# EasyEDA Pro project TOLL四合一电调.epro, schematic 100V_四路_功率板_HYG
Board Name: 100V_四路_功率板_HYG; Create Date: 2025-03-11; Page Name: P1; Project Name: 四合一电调底板; Schematic Name: 100V_四路_功率板_HYG; Update Date: 2025-03-11; Company: urmouky; Drawed: urmouky; Page Size: A4; Reviewed: urmouky; Version: V1.0
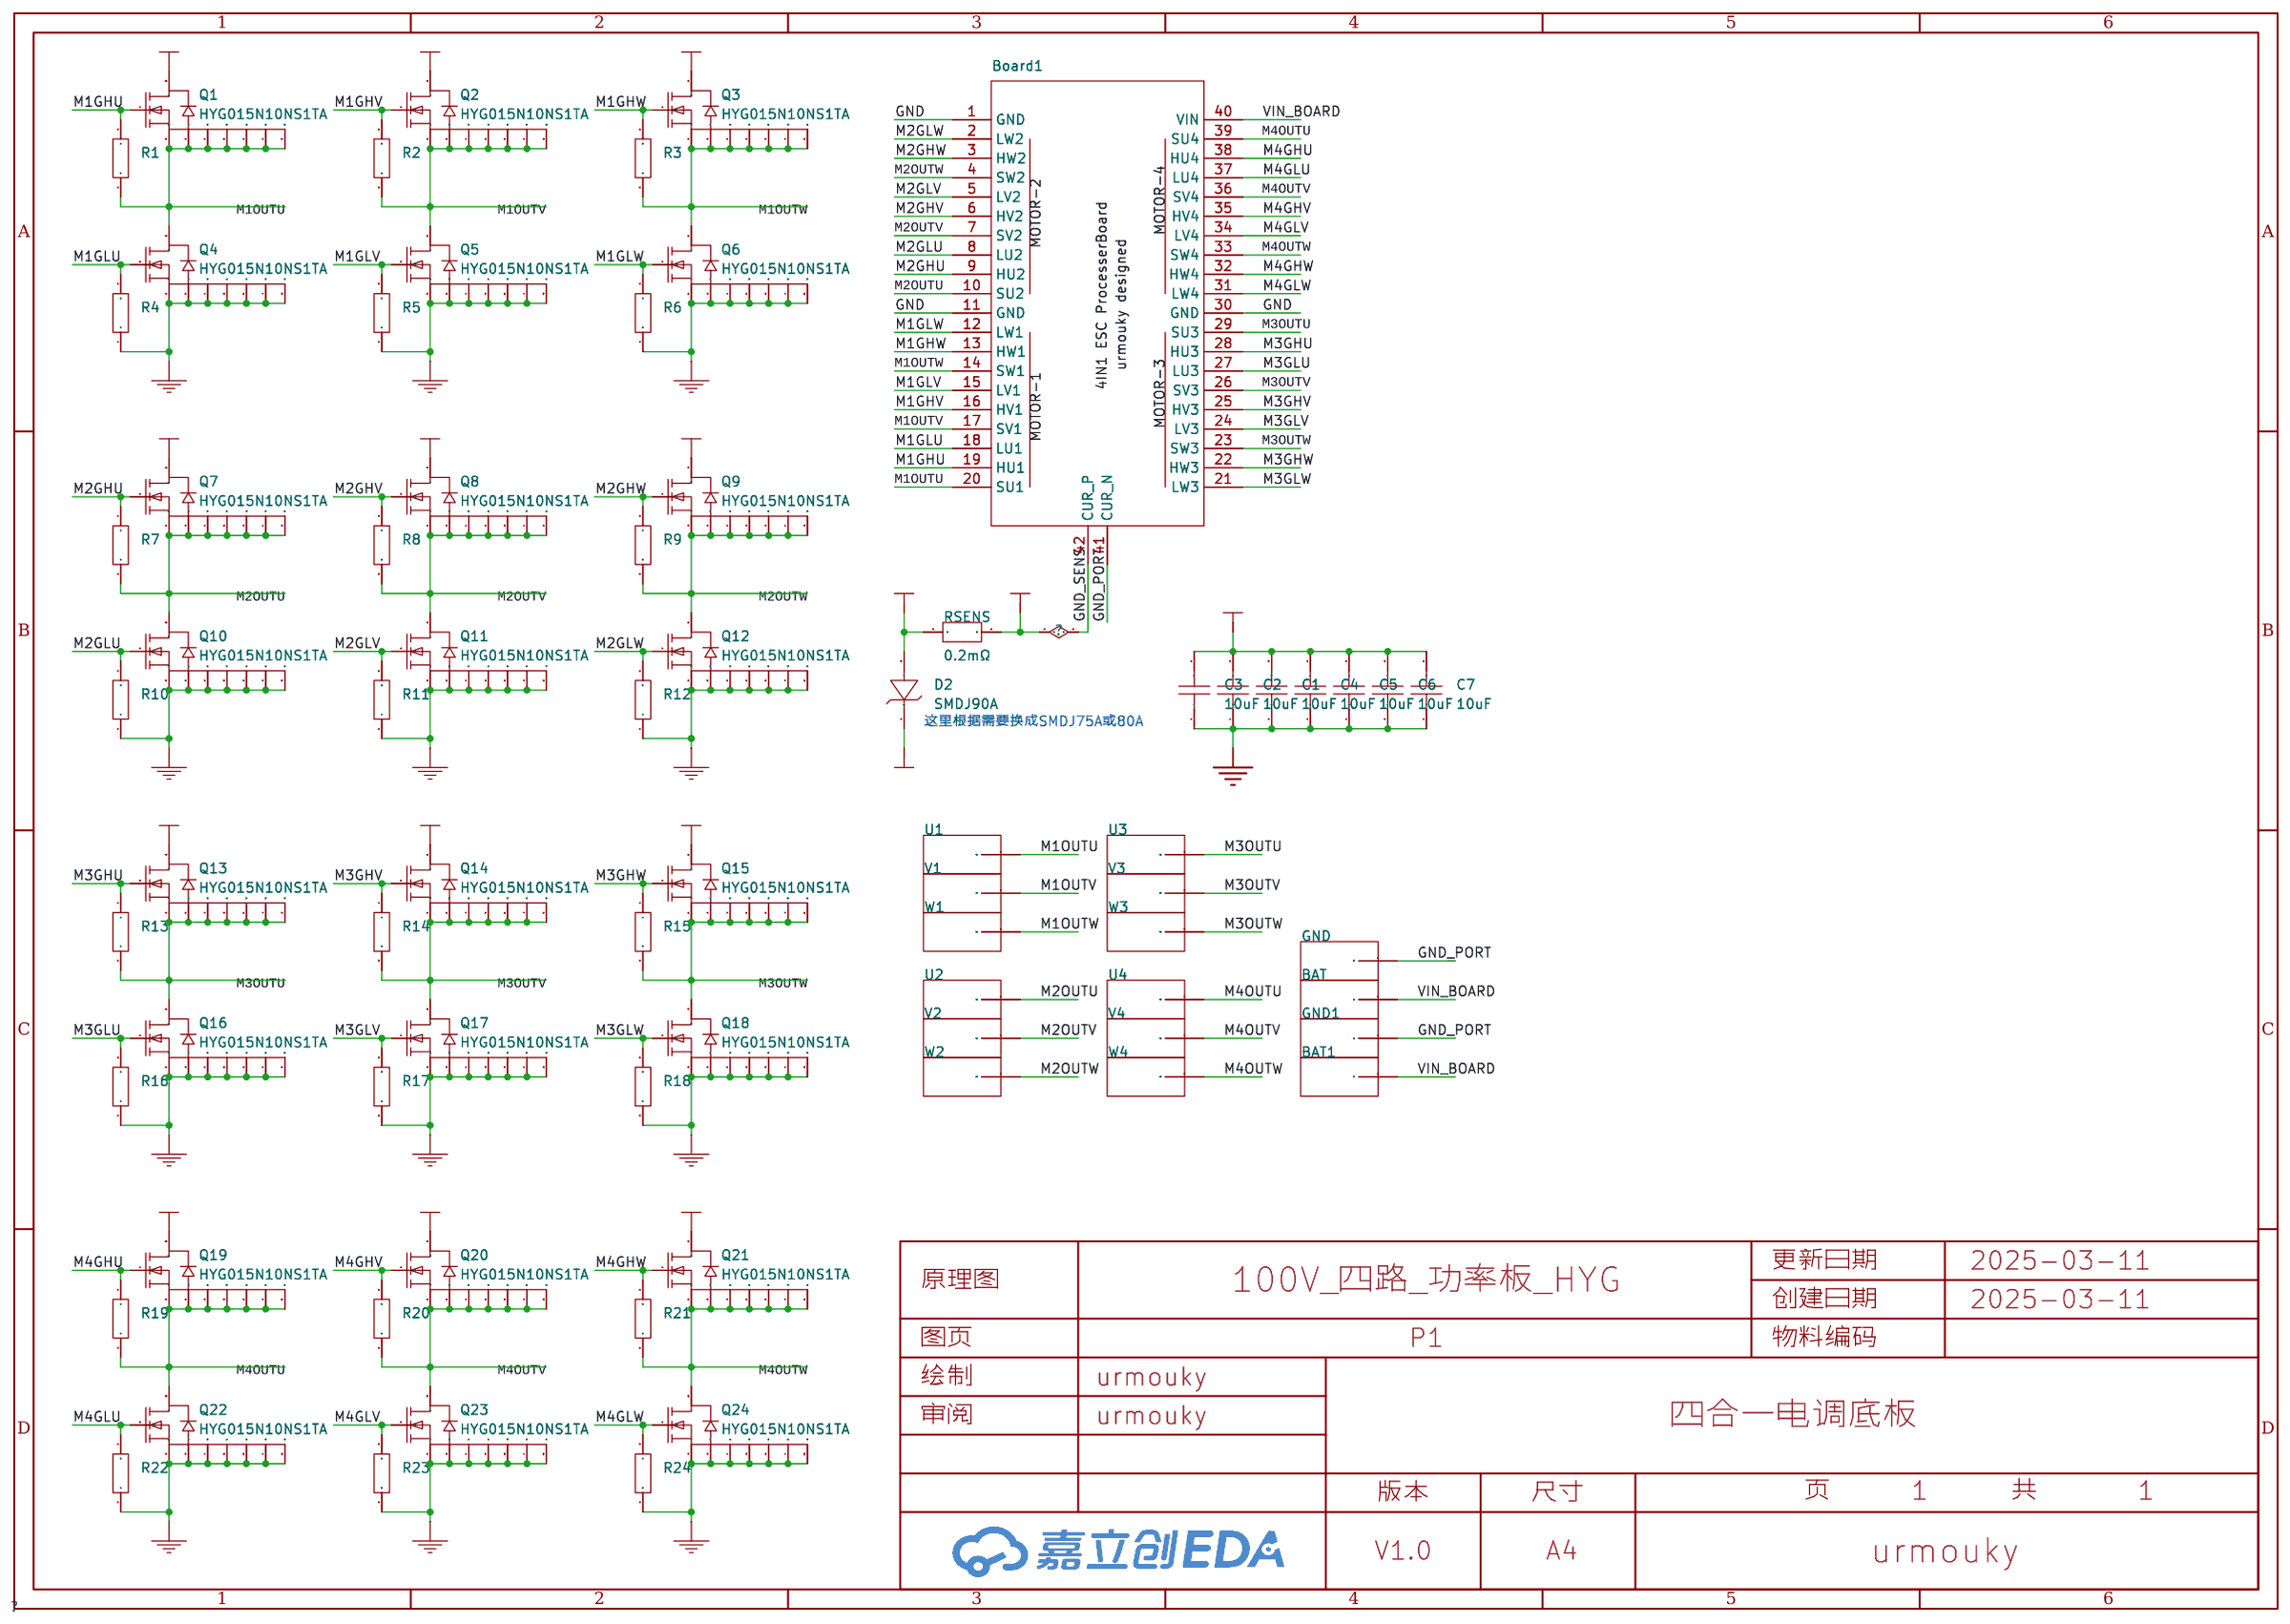
[diagram p0: schematic sheet]

## Parts
BAT  -  [焊盘3*4mm]  (no BOM)
BAT1  -  [焊盘3*4mm]  (no BOM)
Board1  -  [AT32四合一电调控制板]
C1  10uF  [C1206]
C2  10uF  [C1206]
C3  10uF  [C1206]
C4  10uF  [C1206]
C5  10uF  [C1206]
C6  10uF  [C1206]
C7  10uF  [C1206]
D2  SMDJ90A  [SMC_L6.9-W5.9-LS8.0-RD]
GND  -  [焊盘3*4mm]  (no BOM)
GND1  -  [焊盘3*4mm]  (no BOM)
Q1  HYG015N10NS1TA  [TOLL-8_L10.4-W9.9-P1.20-LS11.7-BL]
Q2  HYG015N10NS1TA  [TOLL-8_L10.4-W9.9-P1.20-LS11.7-BL]
Q3  HYG015N10NS1TA  [TOLL-8_L10.4-W9.9-P1.20-LS11.7-BL]
Q4  HYG015N10NS1TA  [TOLL-8_L10.4-W9.9-P1.20-LS11.7-BL]
Q5  HYG015N10NS1TA  [TOLL-8_L10.4-W9.9-P1.20-LS11.7-BL]
Q6  HYG015N10NS1TA  [TOLL-8_L10.4-W9.9-P1.20-LS11.7-BL]
Q7  HYG015N10NS1TA  [TOLL-8_L10.4-W9.9-P1.20-LS11.7-BL]
Q8  HYG015N10NS1TA  [TOLL-8_L10.4-W9.9-P1.20-LS11.7-BL]
Q9  HYG015N10NS1TA  [TOLL-8_L10.4-W9.9-P1.20-LS11.7-BL]
Q10  HYG015N10NS1TA  [TOLL-8_L10.4-W9.9-P1.20-LS11.7-BL]
Q11  HYG015N10NS1TA  [TOLL-8_L10.4-W9.9-P1.20-LS11.7-BL]
Q12  HYG015N10NS1TA  [TOLL-8_L10.4-W9.9-P1.20-LS11.7-BL]
Q13  HYG015N10NS1TA  [TOLL-8_L10.4-W9.9-P1.20-LS11.7-BL]
Q14  HYG015N10NS1TA  [TOLL-8_L10.4-W9.9-P1.20-LS11.7-BL]
Q15  HYG015N10NS1TA  [TOLL-8_L10.4-W9.9-P1.20-LS11.7-BL]
Q16  HYG015N10NS1TA  [TOLL-8_L10.4-W9.9-P1.20-LS11.7-BL]
Q17  HYG015N10NS1TA  [TOLL-8_L10.4-W9.9-P1.20-LS11.7-BL]
Q18  HYG015N10NS1TA  [TOLL-8_L10.4-W9.9-P1.20-LS11.7-BL]
Q19  HYG015N10NS1TA  [TOLL-8_L10.4-W9.9-P1.20-LS11.7-BL]
Q20  HYG015N10NS1TA  [TOLL-8_L10.4-W9.9-P1.20-LS11.7-BL]
Q21  HYG015N10NS1TA  [TOLL-8_L10.4-W9.9-P1.20-LS11.7-BL]
Q22  HYG015N10NS1TA  [TOLL-8_L10.4-W9.9-P1.20-LS11.7-BL]
Q23  HYG015N10NS1TA  [TOLL-8_L10.4-W9.9-P1.20-LS11.7-BL]
Q24  HYG015N10NS1TA  [TOLL-8_L10.4-W9.9-P1.20-LS11.7-BL]
R1  10kΩ  [R0603]
R2  10kΩ  [R0603]
R3  10kΩ  [R0603]
R4  10kΩ  [R0603]
R5  10kΩ  [R0603]
R6  10kΩ  [R0603]
R7  10kΩ  [R0603]
R8  10kΩ  [R0603]
R9  10kΩ  [R0603]
R10  10kΩ  [R0603]
R11  10kΩ  [R0603]
R12  10kΩ  [R0603]
R13  10kΩ  [R0603]
R14  10kΩ  [R0603]
R15  10kΩ  [R0603]
R16  10kΩ  [R0603]
R17  10kΩ  [R0603]
R18  10kΩ  [R0603]
R19  10kΩ  [R0603]
R20  10kΩ  [R0603]
R21  10kΩ  [R0603]
R22  10kΩ  [R0603]
R23  10kΩ  [R0603]
R24  10kΩ  [R0603]
RSENS  0.2mΩ  [R5930]
U1  -  [焊盘3*4mm]  (no BOM)
U2  -  [焊盘3*4mm]  (no BOM)
U3  -  [焊盘3*4mm]  (no BOM)
U4  -  [焊盘3*4mm]  (no BOM)
V1  -  [焊盘3*4mm]  (no BOM)
V2  -  [焊盘3*4mm]  (no BOM)
V3  -  [焊盘3*4mm]  (no BOM)
V4  -  [焊盘3*4mm]  (no BOM)
W1  -  [焊盘3*4mm]  (no BOM)
W2  -  [焊盘3*4mm]  (no BOM)
W3  -  [焊盘3*4mm]  (no BOM)
W4  -  [焊盘3*4mm]  (no BOM)

## Library data of the parts
BAT BAT1 GND GND1 U1-U4 V1-V4 W1-W4 = 焊盘1.6x2.2: 焊盘：1.6mm*2.2mm
Board1 = AT32四合一电调控制板100V
C1-C7 = C3216X6S2A106K160AC: 容值:10uF;精度:±10%;额定电压:100V;材质(温度系数):X6S;; LCSC Part Name: 10uF ±10% 100V; Supplier Part: C6872041; Manufacturer: TDK; Supplier Footprint: 1206; JLCPCB Part Class: 扩展库; Datasheet: https://atta.szlcsc.com/upload/public/pdf/source/231023/files-179e77ec57705f1f6a0fa868e4e425d4.pdf; Supplier: LCSC; Tolerance: ±10%; Voltage Rated: 100V; Temperature Coefficient: X6S
D2 = SMDJ90A_C2842378: 反向截止电压(Vrwm):90V;最大钳位电压:146V;峰值脉冲电流(Ipp)@10/1000us:20.5A;击穿电压:100V;; LCSC Part Name: 单向TVS 90V截止 20.5A峰值脉冲; Supplier Part: C2842378; Manufacturer: BORN(伯恩半导体); Supplier Footprint: DO-214AB; JLCPCB Part Class: 扩展库; Datasheet: https://atta.szlcsc.com/upload/public/pdf/source/20200413/C152077_2BEB0A19CF219C0016744A470088E912.pdf; Supplier: LCSC; Reverse Stand-Off Voltage (Vrwm): 90V; Maximum Clamping Voltage: 146V; Peak Pulse Current (Ipp)@10/1000us: 20.5A; Breakdown Voltage: 100V; Reverse Leakage Current (Ir): 1uA; Type: TVS
Q1-Q24 = HYG015N10NS1TA: 类型:N沟道;漏源电压(Vdss):100V;连续漏极电流(Id):380A;功率(Pd):428.5W;导通电阻(RDS(on)@Vgs,Id):1.2mΩ@10V,100A;阈值电压(Vgs(th)@Id):3V@250uA;; LCSC Part Name: N沟道 耐压:100V 电流:380A; Supplier Part: C2979263; Manufacturer: HUAYI(华羿微); Supplier Footprint: TOLL-8; JLCPCB Part Class: 扩展库; Datasheet: https://atta.szlcsc.com/upload/public/pdf/source/20220303/83427DBE0CDF10F23F3FDD49B9C9CFAE.pdf; Supplier: LCSC; Type: N沟道; Drain Source Voltage (Vdss): 100V; Continuous Drain Current (Id): 380A; Power Dissipation (Pd): 428.5W; Drain Source On Resistance (RDS(on)@Vgs,Id): 1.2mΩ@10V,100A; Gate Threshold Voltage (Vgs(th)@Id): 3V@250uA; Total Gate Charge (Qg@Vgs): 205nC@10V; Input Capacitance (Ciss@Vds): 12.3nF@25V; Reverse Transfer Capacitance (Crss@Vds): 250pF@25V; Operating Temperature: -55℃~+175℃@(Tj)
R1-R24 = 0603WAF1002T5E: 电阻类型:厚膜电阻;阻值:10kΩ;精度:±1%;功率:100mW;最大工作电压:75V;温度系数:±100ppm/℃;; LCSC Part Name: 厚膜电阻 10kΩ ±1% 100mW; Supplier Part: C25804; Manufacturer: UNI-ROYAL(厚声); Supplier Footprint: 0603; JLCPCB Part Class: Basic Part; Datasheet: https://atta.szlcsc.com/upload/public/pdf/source/20200306/C422600_1E6D84923E4A46A82E41ADD87F860B5C.pdf; Supplier: LCSC; Type: 厚膜电阻; Tolerance: ±1%; Power(Watts): 100mW; Overload Voltage (Max): 75V; Temperature Coefficient: ±100ppm/℃; Operating Temperature Range: -55℃~+155℃
RSENS = ASR-M-7-0.2J-t3: 电阻类型:分流器;阻值:0.2mΩ;精度:±5%;额定压降:-;功率:15W;温度系数:±100ppm/℃;安装方式:贴片;; LCSC Part Name: 0.2mΩ ±5% 15W; Supplier Part: C503781; Manufacturer: yezhan(业展); Supplier Footprint: 5930; JLCPCB Part Class: Extended Part; Datasheet: https://atta.szlcsc.com/upload/public/pdf/source/20231030/E912096EFF708041568A0F74B4C79E56.pdf; Supplier: LCSC; Type: 分流器; Tolerance: ±5%; Power(Watts): 15W; Temperature Coefficient: ±100ppm/℃; Mounting Sytle: 贴片

## Nets
GND: Board1.1(GND) Board1.11(GND) Board1.30(GND) Board1.42(CUR_P) C1.1 C2.1 C3.1 C4.1 C5.1 C6.1 C7.1 Q4.2(S) Q4.3(S) Q4.4(S) Q4.5(S) Q4.6(S) Q4.7(S) Q4.8(S) Q5.2(S) Q5.3(S) Q5.4(S) Q5.5(S) Q5.6(S) Q5.7(S) Q5.8(S) Q6.2(S) Q6.3(S) Q6.4(S) Q6.5(S) Q6.6(S) Q6.7(S) Q6.8(S) Q10.2(S) Q10.3(S) Q10.4(S) Q10.5(S) Q10.6(S) Q10.7(S) Q10.8(S) Q11.2(S) Q11.3(S) Q11.4(S) Q11.5(S) Q11.6(S) Q11.7(S) Q11.8(S) Q12.2(S) Q12.3(S) Q12.4(S) Q12.5(S) Q12.6(S) Q12.7(S) Q12.8(S) Q16.2(S) Q16.3(S) Q16.4(S) Q16.5(S) Q16.6(S) Q16.7(S) Q16.8(S) Q17.2(S) Q17.3(S) Q17.4(S) Q17.5(S) Q17.6(S) Q17.7(S) Q17.8(S) Q18.2(S) Q18.3(S) Q18.4(S) Q18.5(S) Q18.6(S) Q18.7(S) Q18.8(S) Q22.2(S) Q22.3(S) Q22.4(S) Q22.5(S) Q22.6(S) Q22.7(S) Q22.8(S) Q23.2(S) Q23.3(S) Q23.4(S) Q23.5(S) Q23.6(S) Q23.7(S) Q23.8(S) Q24.2(S) Q24.3(S) Q24.4(S) Q24.5(S) Q24.6(S) Q24.7(S) Q24.8(S) R4.1 R5.1 R6.1 R10.1 R11.1 R12.1 R16.1 R17.1 R18.1 R22.1 R23.1 R24.1 RSENS.2
GND_PORT: Board1.41(CUR_N) D2.2(A) GND.1(Pad) GND1.1(Pad) RSENS.1
VIN_BOARD: BAT.1(Pad) BAT1.1(Pad) Board1.40(VIN) C1.2 C2.2 C3.2 C4.2 C5.2 C6.2 C7.2 D2.1(C) Q1.9(D) Q2.9(D) Q3.9(D) Q7.9(D) Q8.9(D) Q9.9(D) Q13.9(D) Q14.9(D) Q15.9(D) Q19.9(D) Q20.9(D) Q21.9(D)
M1GHU: Board1.19(HU1) Q1.1(G) R1.1
M1GHV: Board1.16(HV1) Q2.1(G) R2.1
M1GHW: Board1.13(HW1) Q3.1(G) R3.1
M1GLU: Board1.18(LU1) Q4.1(G) R4.2
M1GLV: Board1.15(LV1) Q5.1(G) R5.2
M1GLW: Board1.12(LW1) Q6.1(G) R6.2
M1OUTU: Board1.20(SU1) Q1.2(S) Q1.3(S) Q1.4(S) Q1.5(S) Q1.6(S) Q1.7(S) Q1.8(S) Q4.9(D) R1.2 U1.1(Pad)
M1OUTV: Board1.17(SV1) Q2.2(S) Q2.3(S) Q2.4(S) Q2.5(S) Q2.6(S) Q2.7(S) Q2.8(S) Q5.9(D) R2.2 V1.1(Pad)
M1OUTW: Board1.14(SW1) Q3.2(S) Q3.3(S) Q3.4(S) Q3.5(S) Q3.6(S) Q3.7(S) Q3.8(S) Q6.9(D) R3.2 W1.1(Pad)
M2GHU: Board1.9(HU2) Q7.1(G) R7.1
M2GHV: Board1.6(HV2) Q8.1(G) R8.1
M2GHW: Board1.3(HW2) Q9.1(G) R9.1
M2GLU: Board1.8(LU2) Q10.1(G) R10.2
M2GLV: Board1.5(LV2) Q11.1(G) R11.2
M2GLW: Board1.2(LW2) Q12.1(G) R12.2
M2OUTU: Board1.10(SU2) Q7.2(S) Q7.3(S) Q7.4(S) Q7.5(S) Q7.6(S) Q7.7(S) Q7.8(S) Q10.9(D) R7.2 U2.1(Pad)
M2OUTV: Board1.7(SV2) Q8.2(S) Q8.3(S) Q8.4(S) Q8.5(S) Q8.6(S) Q8.7(S) Q8.8(S) Q11.9(D) R8.2 V2.1(Pad)
M2OUTW: Board1.4(SW2) Q9.2(S) Q9.3(S) Q9.4(S) Q9.5(S) Q9.6(S) Q9.7(S) Q9.8(S) Q12.9(D) R9.2 W2.1(Pad)
M3GHU: Board1.28(HU3) Q13.1(G) R13.1
M3GHV: Board1.25(HV3) Q14.1(G) R14.1
M3GHW: Board1.22(HW3) Q15.1(G) R15.1
M3GLU: Board1.27(LU3) Q16.1(G) R16.2
M3GLV: Board1.24(LV3) Q17.1(G) R17.2
M3GLW: Board1.21(LW3) Q18.1(G) R18.2
M3OUTU: Board1.29(SU3) Q13.2(S) Q13.3(S) Q13.4(S) Q13.5(S) Q13.6(S) Q13.7(S) Q13.8(S) Q16.9(D) R13.2 U3.1(Pad)
M3OUTV: Board1.26(SV3) Q14.2(S) Q14.3(S) Q14.4(S) Q14.5(S) Q14.6(S) Q14.7(S) Q14.8(S) Q17.9(D) R14.2 V3.1(Pad)
M3OUTW: Board1.23(SW3) Q15.2(S) Q15.3(S) Q15.4(S) Q15.5(S) Q15.6(S) Q15.7(S) Q15.8(S) Q18.9(D) R15.2 W3.1(Pad)
M4GHU: Board1.38(HU4) Q19.1(G) R19.1
M4GHV: Board1.35(HV4) Q20.1(G) R20.1
M4GHW: Board1.32(HW4) Q21.1(G) R21.1
M4GLU: Board1.37(LU4) Q22.1(G) R22.2
M4GLV: Board1.34(LV4) Q23.1(G) R23.2
M4GLW: Board1.31(LW4) Q24.1(G) R24.2
M4OUTU: Board1.39(SU4) Q19.2(S) Q19.3(S) Q19.4(S) Q19.5(S) Q19.6(S) Q19.7(S) Q19.8(S) Q22.9(D) R19.2 U4.1(Pad)
M4OUTV: Board1.36(SV4) Q20.2(S) Q20.3(S) Q20.4(S) Q20.5(S) Q20.6(S) Q20.7(S) Q20.8(S) Q23.9(D) R20.2 V4.1(Pad)
M4OUTW: Board1.33(SW4) Q21.2(S) Q21.3(S) Q21.4(S) Q21.5(S) Q21.6(S) Q21.7(S) Q21.8(S) Q24.9(D) R21.2 W4.1(Pad)

## Notes on the sheet
- 这里根据需要换成SMDJ75A或80A
